# EAGLE schematic pdp8-badge_rev1 (EAGLE 7.2.0)

## Sheet 1 of 2: MCU & Interfaces
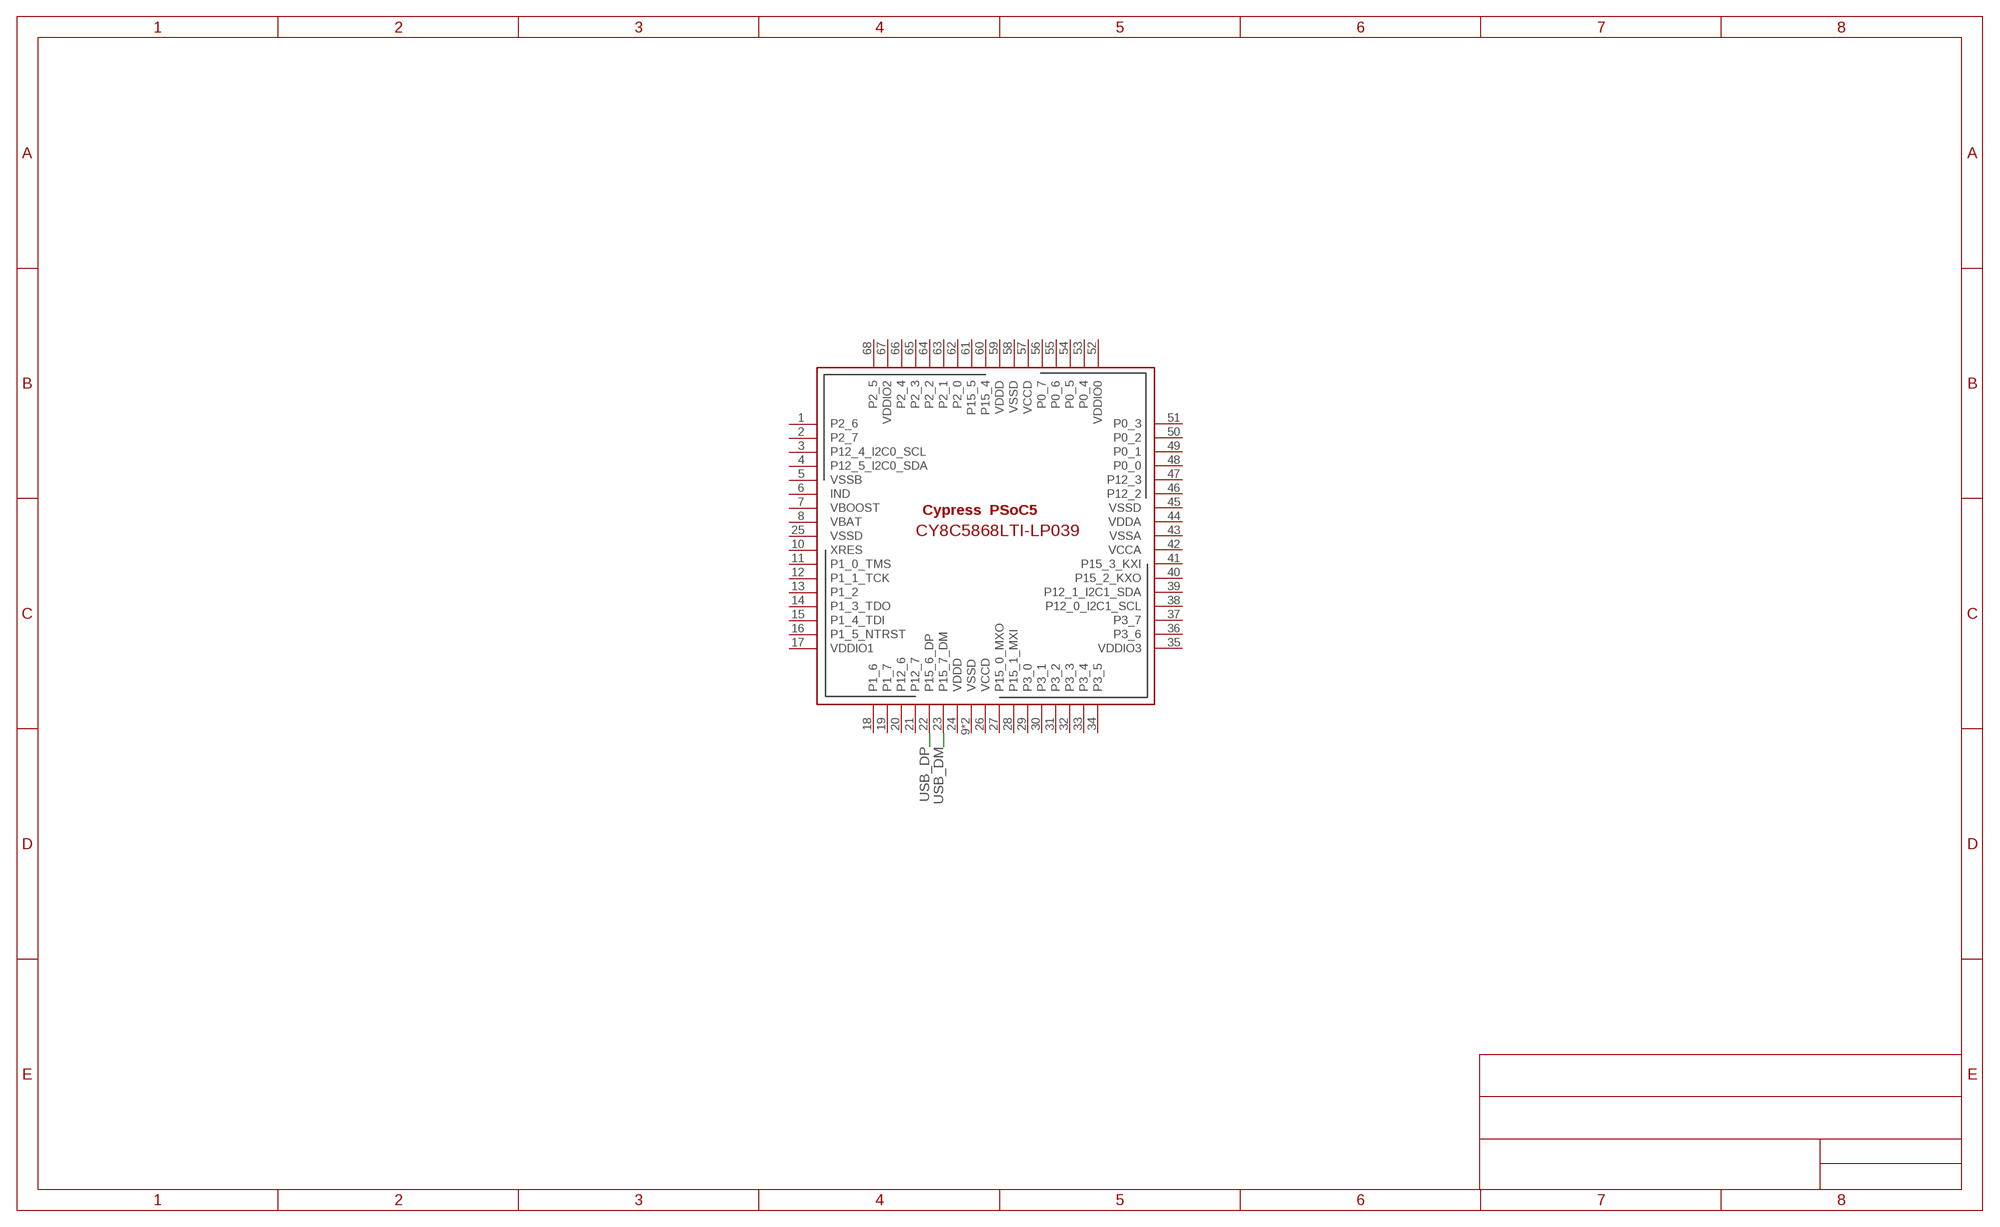
[diagram p0: schematic, sheet 1]

### Parts
U1  CY8C5268LTI-LP030  CY8C5XXX-68-N  [QFN68N]

### Nets
USB_DM: U1.23(P15_7_DM)
USB_DP: U1.22(P15_6_DP)
Unconnected: U1.1(P2_6) U1.2(P2_7) U1.3(P12_4_I2C0_SCL) U1.4(P12_5_I2C0_SDA) U1.5(VSSB) U1.6(IND) U1.7(VBOOST) U1.8(VBAT) U1.9(VSSD) U1.10(XRES) U1.11(P1_0_TMS) U1.12(P1_1_TCK) U1.13(P1_2) U1.14(P1_3_TDO) U1.15(P1_4_TDI) U1.16(P1_5_NTRST) U1.17(VDDIO1) U1.18(P1_6) U1.19(P1_7) U1.20(P12_6) U1.21(P12_7) U1.24(VDDD) U1.25(VSSD) U1.26(VCCD) U1.27(P15_0_MXO) U1.28(P15_1_MXI) U1.29(P3_0) U1.30(P3_1) U1.31(P3_2) U1.32(P3_3) U1.33(P3_4) U1.34(P3_5) U1.35(VDDIO3) U1.36(P3_6) U1.37(P3_7) U1.38(P12_0_I2C1_SCL) U1.39(P12_1_I2C1_SDA) U1.40(P15_2_KXO) U1.41(P15_3_KXI) U1.42(VCCA) U1.43(VSSA) U1.44(VDDA) U1.45(VSSD) U1.46(P12_2) U1.47(P12_3) U1.48(P0_0) U1.49(P0_1) U1.50(P0_2) U1.51(P0_3) U1.52(VDDIO0) U1.53(P0_4) U1.54(P0_5) U1.55(P0_6) U1.56(P0_7) U1.57(VCCD) U1.58(VSSD) U1.59(VDDD) U1.60(P15_4) U1.61(P15_5) U1.62(P2_0) U1.63(P2_1) U1.64(P2_2) U1.65(P2_3) U1.66(P2_4) U1.67(VDDIO2) U1.68(P2_5) U1.EPAD(VSSD)

## Sheet 2 of 2: General LED
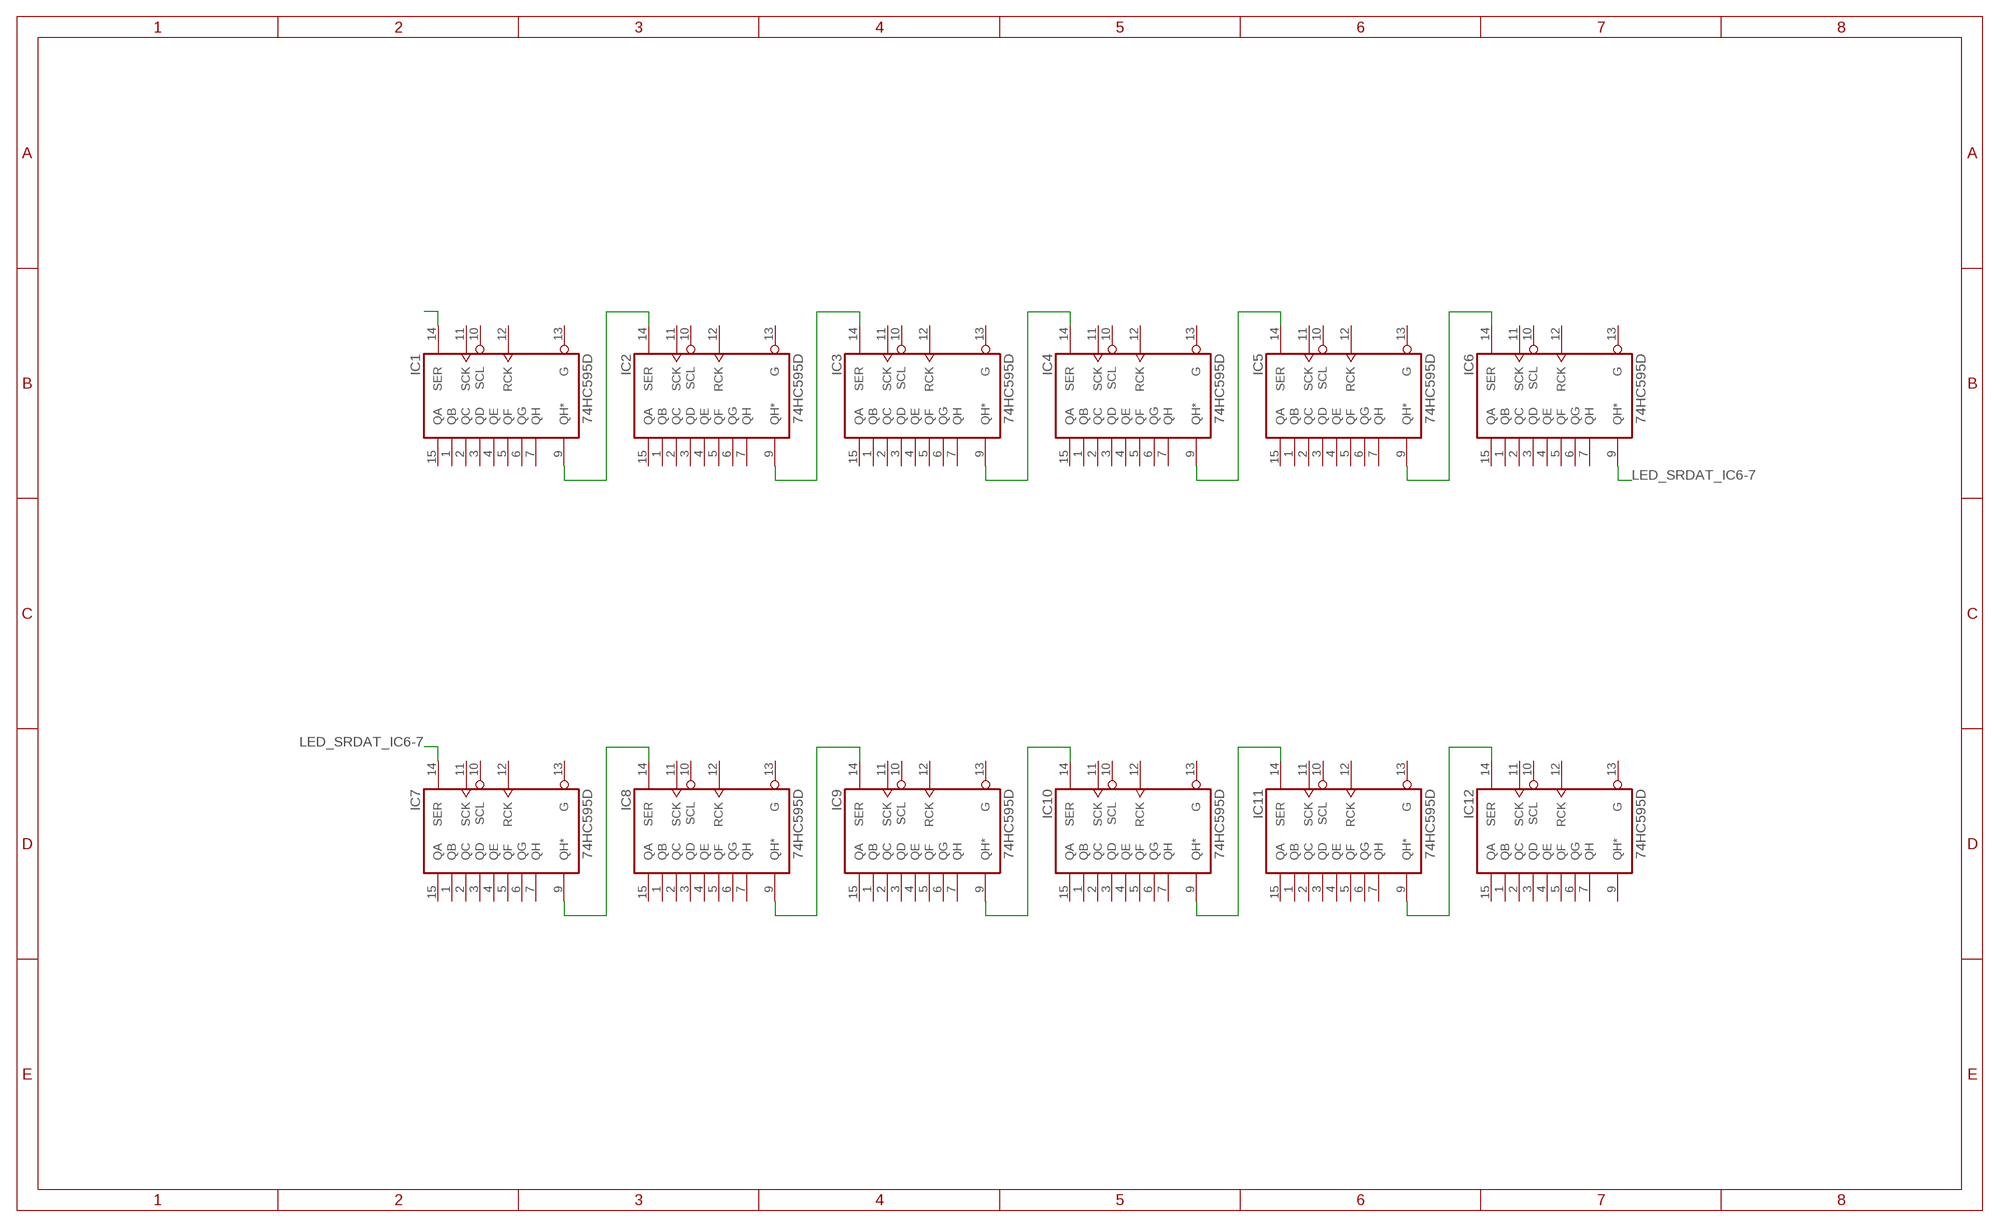
[diagram p1: schematic, sheet 2]

### Parts
IC1  74HC595D  [SO16]
IC2  74HC595D  [SO16]
IC3  74HC595D  [SO16]
IC4  74HC595D  [SO16]
IC5  74HC595D  [SO16]
IC6  74HC595D  [SO16]
IC7  74HC595D  [SO16]
IC8  74HC595D  [SO16]
IC9  74HC595D  [SO16]
IC10  74HC595D  [SO16]
IC11  74HC595D  [SO16]
IC12  74HC595D  [SO16]

### Nets
LED_SRDAT: IC1.14(SER)
LED_SRDAT_IC1-2: IC1.9(QH*) IC2.14(SER)
LED_SRDAT_IC2-3: IC2.9(QH*) IC3.14(SER)
LED_SRDAT_IC3-4: IC3.9(QH*) IC4.14(SER)
LED_SRDAT_IC4-5: IC4.9(QH*) IC5.14(SER)
LED_SRDAT_IC5-6: IC5.9(QH*) IC6.14(SER)
LED_SRDAT_IC6-7: IC6.9(QH*) IC7.14(SER)
LED_SRDAT_IC7-8: IC7.9(QH*) IC8.14(SER)
LED_SRDAT_IC8-9: IC8.9(QH*) IC9.14(SER)
LED_SRDAT_IC9-10: IC9.9(QH*) IC10.14(SER)
LED_SRDAT_IC10-11: IC10.9(QH*) IC11.14(SER)
LED_SRDAT_IC11-12: IC11.9(QH*) IC12.14(SER)
Unconnected: IC1.1(QB) IC1.2(QC) IC1.3(QD) IC1.4(QE) IC1.5(QF) IC1.6(QG) IC1.7(QH) IC1.10(SCL) IC1.11(SCK) IC1.12(RCK) IC1.13(G) IC1.15(QA) IC2.1(QB) IC2.2(QC) IC2.3(QD) IC2.4(QE) IC2.5(QF) IC2.6(QG) IC2.7(QH) IC2.10(SCL) IC2.11(SCK) IC2.12(RCK) IC2.13(G) IC2.15(QA) IC3.1(QB) IC3.2(QC) IC3.3(QD) IC3.4(QE) IC3.5(QF) IC3.6(QG) IC3.7(QH) IC3.10(SCL) IC3.11(SCK) IC3.12(RCK) IC3.13(G) IC3.15(QA) IC4.1(QB) IC4.2(QC) IC4.3(QD) IC4.4(QE) IC4.5(QF) IC4.6(QG) IC4.7(QH) IC4.10(SCL) IC4.11(SCK) IC4.12(RCK) IC4.13(G) IC4.15(QA) IC5.1(QB) IC5.2(QC) IC5.3(QD) IC5.4(QE) IC5.5(QF) IC5.6(QG) IC5.7(QH) IC5.10(SCL) IC5.11(SCK) IC5.12(RCK) IC5.13(G) IC5.15(QA) IC6.1(QB) IC6.2(QC) IC6.3(QD) IC6.4(QE) IC6.5(QF) IC6.6(QG) IC6.7(QH) IC6.10(SCL) IC6.11(SCK) IC6.12(RCK) IC6.13(G) IC6.15(QA) IC7.1(QB) IC7.2(QC) IC7.3(QD) IC7.4(QE) IC7.5(QF) IC7.6(QG) IC7.7(QH) IC7.10(SCL) IC7.11(SCK) IC7.12(RCK) IC7.13(G) IC7.15(QA) IC8.1(QB) IC8.2(QC) IC8.3(QD) IC8.4(QE) IC8.5(QF) IC8.6(QG) IC8.7(QH) IC8.10(SCL) IC8.11(SCK) IC8.12(RCK) IC8.13(G) IC8.15(QA) IC9.1(QB) IC9.2(QC) IC9.3(QD) IC9.4(QE) IC9.5(QF) IC9.6(QG) IC9.7(QH) IC9.10(SCL) IC9.11(SCK) IC9.12(RCK) IC9.13(G) IC9.15(QA) IC10.1(QB) IC10.2(QC) IC10.3(QD) IC10.4(QE) IC10.5(QF) IC10.6(QG) IC10.7(QH) IC10.10(SCL) IC10.11(SCK) IC10.12(RCK) IC10.13(G) IC10.15(QA) IC11.1(QB) IC11.2(QC) IC11.3(QD) IC11.4(QE) IC11.5(QF) IC11.6(QG) IC11.7(QH) IC11.10(SCL) IC11.11(SCK) IC11.12(RCK) IC11.13(G) IC11.15(QA) IC12.1(QB) IC12.2(QC) IC12.3(QD) IC12.4(QE) IC12.5(QF) IC12.6(QG) IC12.7(QH) IC12.9(QH*) IC12.10(SCL) IC12.11(SCK) IC12.12(RCK) IC12.13(G) IC12.15(QA)

## Power pins joined to a net without a drawn wire
GND: IC1.8(GND) IC2.8(GND) IC3.8(GND) IC4.8(GND) IC5.8(GND) IC6.8(GND) IC7.8(GND) IC8.8(GND) IC9.8(GND) IC10.8(GND) IC11.8(GND) IC12.8(GND)
VCC: IC1.16(VCC) IC2.16(VCC) IC3.16(VCC) IC4.16(VCC) IC5.16(VCC) IC6.16(VCC) IC7.16(VCC) IC8.16(VCC) IC9.16(VCC) IC10.16(VCC) IC11.16(VCC) IC12.16(VCC)

## Library data of the parts
IC1-IC12 = 74xx-eu:74*595: 8-bit SHIFT REGISTER, output latch
U1 = PatternAgents-Cypress:CY8C5XXX-68: Cypress PSoC® 5 - Programmable System on Chip, ARM Cortex-M3 Based Source Data: http://www.cypress.com/?mpn=CY8C5868LTI-LP038 PKG Source: http://www.cypress.com/?docID=38892 LBR Source: http://www.patternagents.com THIS SOFTWARE IS PROVIDED BY THE CONTRIBUTORS "AS IS" AND WITHOUT ANY EXPRESS OR IMPLIED WARRANTIES, INCLUDING, BUT NOT LIMITED TO, THE IMPLIED WARRANTIES OF MERCHANTABILITY AND FITNESS FOR A PARTICULAR PURPOSE ARE DISCLAIMED. IN NO EVENT SHALL THE COPYRIGHT OWNER OR CONTRIBUTORS BE LIABLE FOR ANY DIRECT, INDIRECT, INCIDENTAL, SPECIAL, EXEMPLARY, OR CONSEQUENTIAL DAMAGES (INCLUDING, BUT NOT LIMITED TO, PROCUREMENT OF SUBSTITUTE GOODS OR SERVICES; LOSS OF USE, DATA, OR PROFITS; OR BUSINESS INTERRUPTION) HOWEVER CAUSED AND ON ANY THEORY OF LIABILITY, WHETHER IN CONTRACT, STRICT LIABILITY, OR TORT (INCLUDING NEGLIGENCE OR OTHERWISE) ARISING IN ANY WAY OUT OF THE USE OF THIS SOFTWARE, EVEN IF ADVISED OF THE POSSIBILITY OF SUCH DAMAGE.